# EAGLE design amp_pcb (EAGLE 6.3)
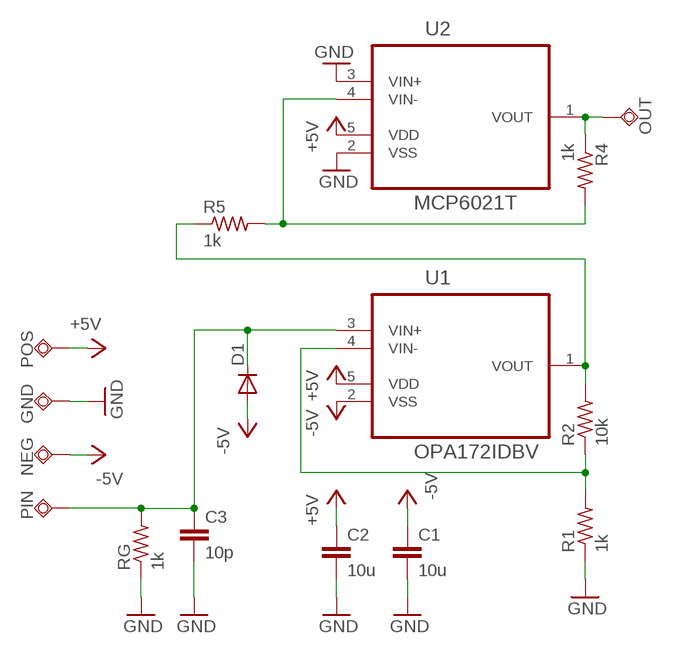
[diagram p0: schematic, sheet 1]

## Parts
C1  10u  C-EUC0603  [C0603]
C2  10u  C-EUC0603  [C0603]
C3  10p  C-EUC0603  [C0603]
D1  DIODE-DO214AA  [DO214AA]
GND  TPSQTP15SQ  [TP15SQ]
NEG  TPSQTP15SQ  [TP15SQ]
OUT  TPSQTP15SQ  [TP15SQ]
PIN  TPSQTP15SQ  [TP15SQ]
POS  TPSQTP15SQ  [TP15SQ]
R1  1k  R-US_R0603  [R0603]
R2  10k  R-US_R0603  [R0603]
R4  1k  R-US_R0603  [R0603]
R5  1k  R-US_R0603  [R0603]
RG  1k  R-US_R0603  [R0603]
U1  OPA172IDBV  MCP6021T-E/OT  [SOT95P320X145-5N]
U2  MCP6021T  MCP6021T-E/OT  [SOT95P320X145-5N]

## Nets
+5V: C2.1 POS.TP U1.5(VDD) U2.5(VDD)
-5V: C1.1 D1.A NEG.TP U1.2(VSS)
GND: C1.2 C2.2 C3.2 GND.TP R1.1 RG.1 U2.2(VSS) U2.3(VIN+)
N$1: R1.2 R2.1 U1.4(VIN-)
N$2: R2.2 R5.1 U1.1(VOUT)
N$3: C3.1 D1.C PIN.TP RG.2 U1.3(VIN+)
N$4: OUT.TP R4.1 U2.1(VOUT)
N$5: R4.2 R5.2 U2.4(VIN-)

## Library data of the parts
C1-C3 = resistor:C-EU: CAPACITOR, European symbol
D1 = diode:DIODE-: DIODE
GND NEG OUT PIN POS = testpad:TPSQ: Test pad
R1 R2 R4 R5 RG = resistor:R-US_: RESISTOR, American symbol
U1 U2 = microchip_by_element14_batch_1:MCP6021T-E/OT: IC OPAMP 2.5V R-R I/O; MPN: MCP6021T-E/OT; OC_FARNELL: 1605573; OC_NEWARK: 84R5185; PACKAGE: SOT23-5; SUPPLIER: Microchip

## Board
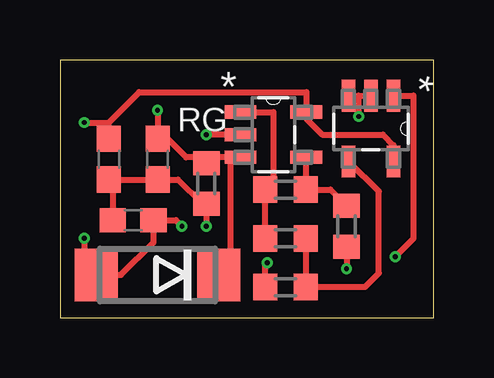
[diagram p1: board, top side]
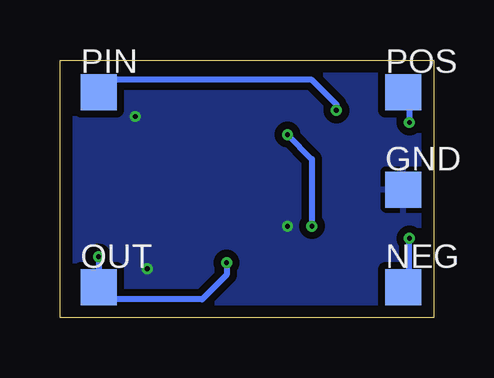
[diagram p2: board, bottom side, seen from below]

Size 15.58 x 10.73 mm. Coordinates in mm from the lower left corner, seen from the top.
Outline: 0,0 15.58,0 15.58,10.73 0,10.73 0,0
Copper layers (1*16): Top 0.035mm / dielectric 1.5mm / Bottom 0.035mm
Design rules "PCBCart-proto *": minimum track width 5mil, minimum drill 0.2mm, track to track 6mil, track to pad 6mil, pad to pad 6mil, via to via 6mil, smd to smd 5mil, copper to edge 20mil, drill to drill 8mil, minimum pad ring 8mil, minimum via ring 5mil, stop-mask expansion 3mil, vias tented up to drill 0mil, thermal gap 8mil

### Footprints (pad centres in the part's own frame; a part is rotated, then mirrored left to right if it is on the bottom)
C0603 = smd 1.1 x 1: 1 -0.85,0; 2 0.85,0
DO214AA = smd 1.8 x 2.2: A 2.55,0; C -2.55,0
TP15SQ = smd 1.5 x 1.5: TP 0,0
R0603 = smd 1 x 1.1: 1 -0.85,0; 2 0.85,0
SOT95P320X145-5N = smd 1.321 x 0.559: 1 -1.372,0.94; 2 -1.372,0; 3 -1.372,-0.94; 4 1.372,-0.94; 5 1.372,0.94

### Placement (x,y rotation side)
C1  3.05,4.06 180 top
C2  2.03,6.6 270 top
C3  4.06,6.6 270 top
D1  4.06,1.78 180 top
GND  1.27,5.33 0 bottom
NEG  1.27,1.27 0 bottom
OUT  13.97,1.27 0 bottom
PIN  13.97,9.4 0 bottom
POS  1.27,9.4 0 bottom
R1  11.94,3.81 90 top
R2  9.4,5.33 180 top
R4  9.4,1.27 0 top
R5  9.4,3.3 0 top
RG  6.1,5.59 90 top
U1  8.89,7.62 0 top
U2  12.95,7.87 270 top

### Tracks (layer width: path | path; a pad name or v marks a point on that pad's centre or on a via)
+5V  (via drill 0.2)
  Top 0.254: C2.1 2.03,8.13 | 2.03,8.13 3.3,9.4 10.26,9.4 U1.5 10.26,8.28 10.92,7.62 13.46,7.62 13.89,7.19 U2.5 | v1.02,8.13 2.03,8.13
  Bottom 0.254: POS.TP 1.02,9.4 v1.02,8.13
-5V  (via drill 0.2)
  Top 0.254: v5.08,3.81 4.83,4.06 C1.1 3.9,3.14 2.54,1.78 D1.A 1,1.78 v1.02,3.3 | U1.2 v6.1,7.62
  Bottom 0.254: v6.1,7.62 5.08,6.6 v5.08,3.81 | NEG.TP 1.02,1.27 v1.02,3.3
GND  (via drill 0.2)
  Top 0.254: U2.3 U2.2 12.45,9.25 v12.45,8.38 | v6.1,3.81 RG.1 5.93,4.74 4.91,5.75 C3.2 C2.2 2.2,5.75 C1.2 | R1.1 v11.94,2.03
  pour Bottom (isolate 0.305): -0.25,11.18 16,11.18 16,-0.76 -0.25,-0.76
N$1
  Top 0.254: U1.4 10.25,6.68 R2.1 11.26,5.33 R1.2
N$2
  Top 0.254: U1.1 8.89,8.56 8.89,5.33 R2.2 R5.1
N$3  (via drill 0.2)
  Top 0.254: U1.3 7.11,6.68 | D1.C 7.11,1.78 7.11,6.68 | v4.06,8.64 C3.1 4.48,7.45 5.26,6.68 6.1,6.68 | 7.11,6.68 6.1,6.68 | 6.1,6.68 RG.2
  Bottom 0.254: v4.06,8.64 4.06,8.89 5.08,9.91 13.46,9.91 PIN.TP
N$4  (via drill 0.2)
  Top 0.254: U2.1 14.73,9.25 14.73,3.3 v13.97,2.54 | R4.1 8.55,2.2 v8.64,2.29
  Bottom 0.254: v13.97,2.54 OUT.TP 13.46,0.76 9.65,0.76 8.64,1.78 v8.64,2.29
N$5
  Top 0.254: R5.2 R4.2 12.7,1.27 13.28,1.85 13.28,5.26 12.04,6.5 U2.4